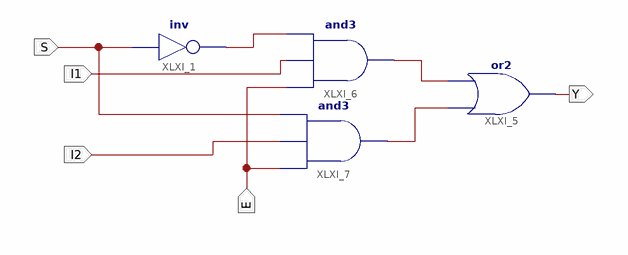
[diagram p0: schematic sheet 1]
// Xilinx ISE schematic MUX_2_1.sch (artix7) as structural Verilog: 4 symbols, 5 ports
module MUX_2_1 (
  input  I1,
  input  I2,
  input  E,
  input  S,
  output Y
);

  wire XLXN_5, XLXN_7, XLXN_11;

  not XLXI_1 (XLXN_7, S);
  or XLXI_5 (Y, XLXN_5, XLXN_11);
  and XLXI_6 (XLXN_11, E, I1, XLXN_7);
  and XLXI_7 (XLXN_5, E, I2, S);
endmodule
